# EAGLE design carrierboard (EAGLE 9.6.2)
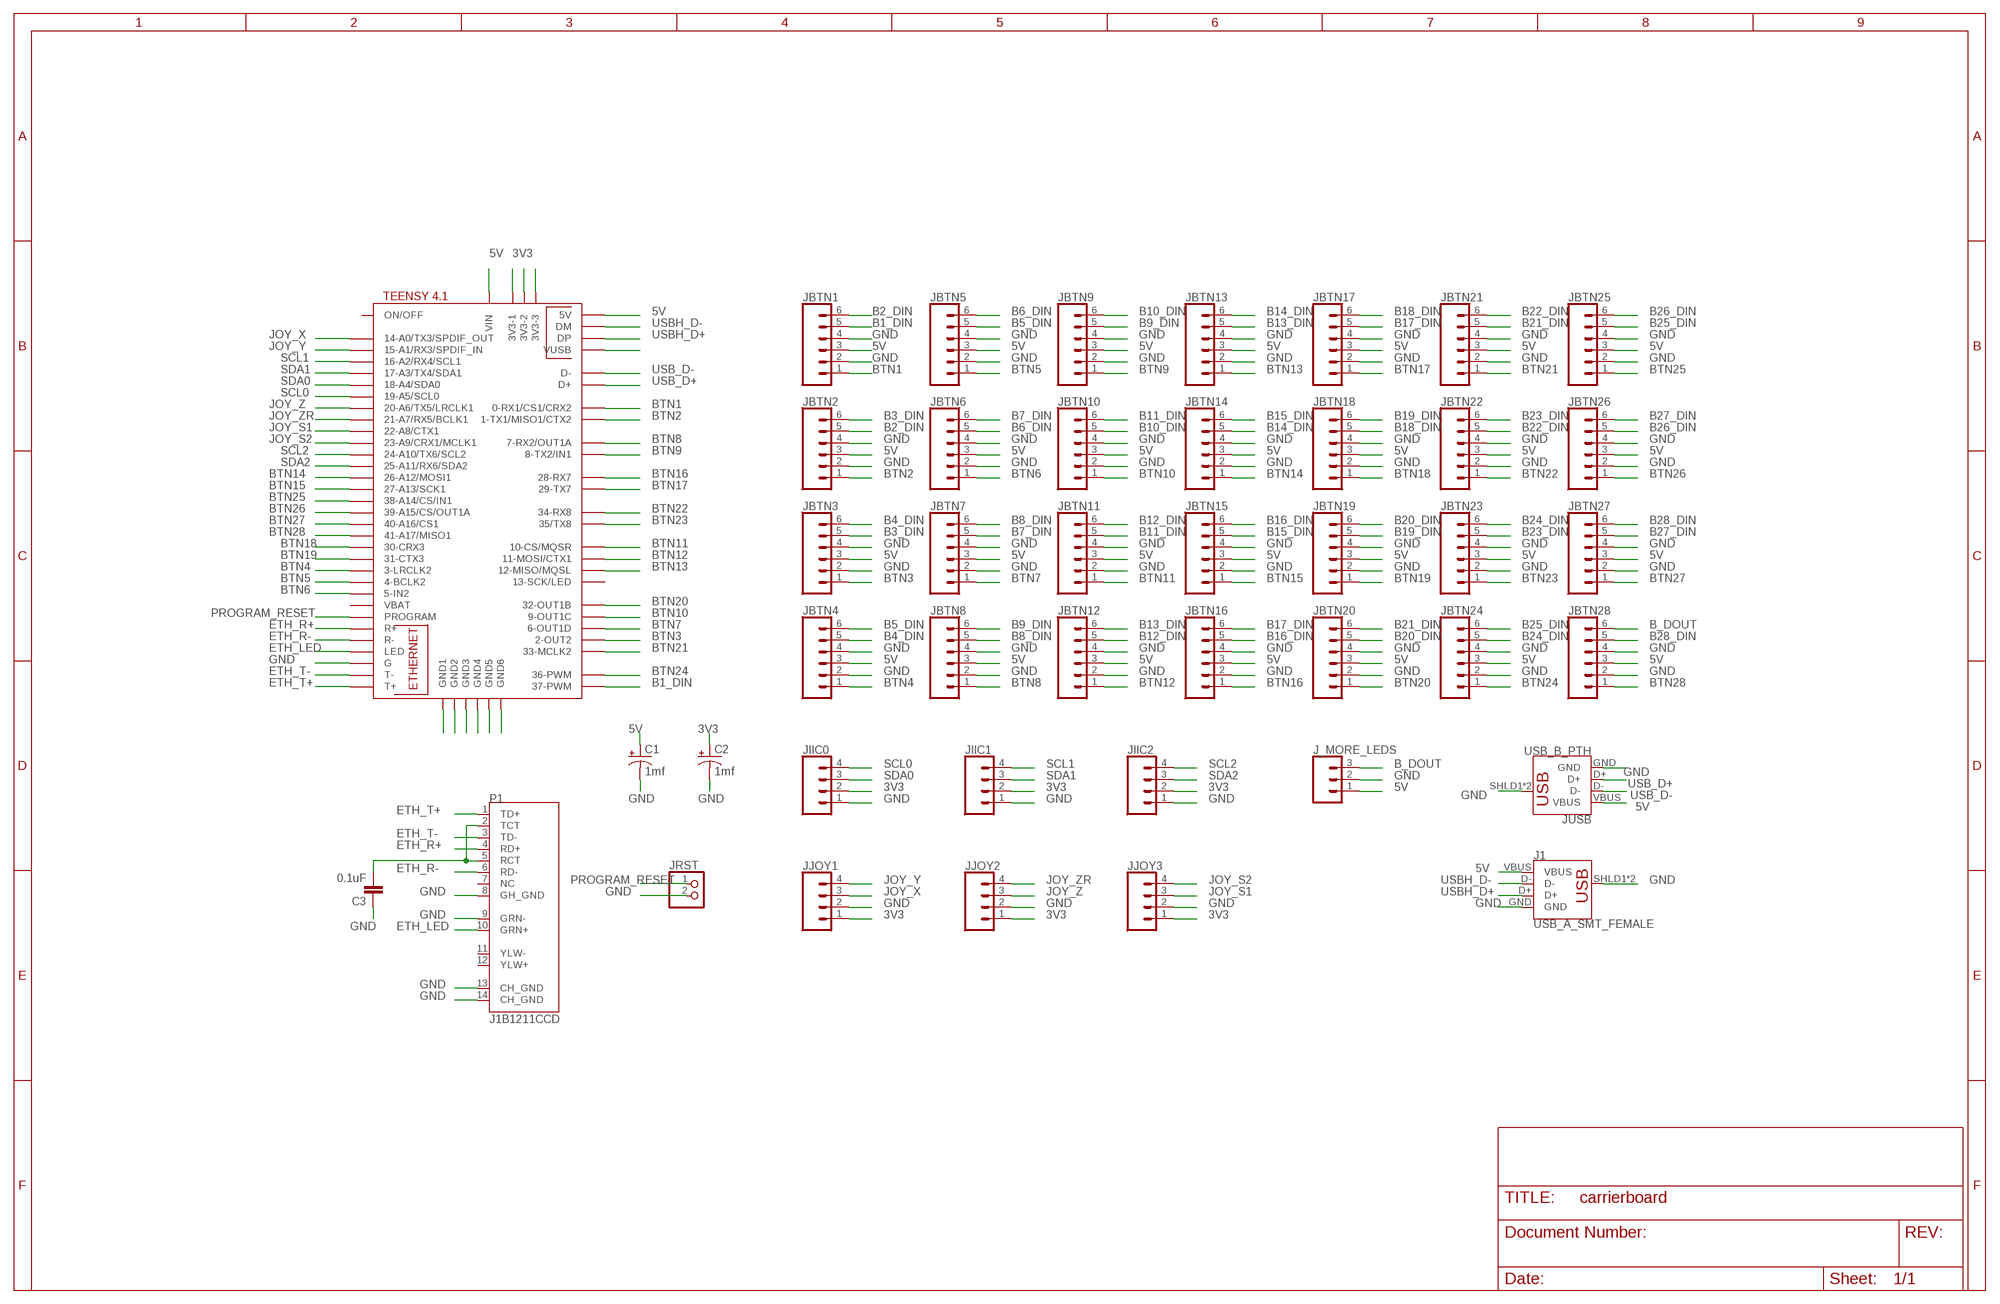
[diagram p0: schematic, sheet 1]

## Parts
C1  1mf  1000UF-RADIAL-5MM-35V-20%-KIT  [CPOL-RADIAL-5MM-10MM-KIT]
C2  1mf  1000UF-RADIAL-5MM-35V-20%-KIT  [CPOL-RADIAL-5MM-10MM-KIT]
C3  0.1uF  0.1UF-KIT-EZ-50V-20%  [CAP-PTH-SMALL-KIT]
J1  USB_A_SMT_FEMALE  [USB-A-S-SILK-FEMALE]
J_MORE_LEDS  CONN_03LONGPADS  [1X03_LONGPADS]
JBTN1  CONN_06SILK_FEMALE_PTH  [1X06]
JBTN2  CONN_06SILK_FEMALE_PTH  [1X06]
JBTN3  CONN_06SILK_FEMALE_PTH  [1X06]
JBTN4  CONN_06SILK_FEMALE_PTH  [1X06]
JBTN5  CONN_06SILK_FEMALE_PTH  [1X06]
JBTN6  CONN_06SILK_FEMALE_PTH  [1X06]
JBTN7  CONN_06SILK_FEMALE_PTH  [1X06]
JBTN8  CONN_06SILK_FEMALE_PTH  [1X06]
JBTN9  CONN_06SILK_FEMALE_PTH  [1X06]
JBTN10  CONN_06SILK_FEMALE_PTH  [1X06]
JBTN11  CONN_06SILK_FEMALE_PTH  [1X06]
JBTN12  CONN_06SILK_FEMALE_PTH  [1X06]
JBTN13  CONN_06SILK_FEMALE_PTH  [1X06]
JBTN14  CONN_06SILK_FEMALE_PTH  [1X06]
JBTN15  CONN_06SILK_FEMALE_PTH  [1X06]
JBTN16  CONN_06SILK_FEMALE_PTH  [1X06]
JBTN17  CONN_06SILK_FEMALE_PTH  [1X06]
JBTN18  CONN_06SILK_FEMALE_PTH  [1X06]
JBTN19  CONN_06SILK_FEMALE_PTH  [1X06]
JBTN20  CONN_06SILK_FEMALE_PTH  [1X06]
JBTN21  CONN_06SILK_FEMALE_PTH  [1X06]
JBTN22  CONN_06SILK_FEMALE_PTH  [1X06]
JBTN23  CONN_06SILK_FEMALE_PTH  [1X06]
JBTN24  CONN_06SILK_FEMALE_PTH  [1X06]
JBTN25  CONN_06SILK_FEMALE_PTH  [1X06]
JBTN26  CONN_06SILK_FEMALE_PTH  [1X06]
JBTN27  CONN_06SILK_FEMALE_PTH  [1X06]
JBTN28  CONN_06SILK_FEMALE_PTH  [1X06]
JIIC0  CONN_04POLAR  [MOLEX-1X4]
JIIC1  CONN_04POLAR  [MOLEX-1X4]
JIIC2  CONN_04POLAR  [MOLEX-1X4]
JJOY1  CONN_04LONGPADS  [1X04_LONGPADS]
JJOY2  CONN_04LONGPADS  [1X04_LONGPADS]
JJOY3  CONN_04LONGPADS  [1X04_LONGPADS]
JRST  PINHD-1X2  [1X02]
JUSB  USB_B_PTH  [USB-B-PTH]
P1  J1B1211CCD  [J1B1211CCD]
U$1  TEENSY41  [TEENSY41]

## Nets
3V3 [Power and Gnd]: C2.+ JIIC0.2 JIIC1.2 JIIC2.2 JJOY1.1 JJOY2.1 JJOY3.1 U$1.3V3-1 U$1.3V3-2 U$1.3V3-3
5V [Power and Gnd]: C1.+ J1.VBUS J_MORE_LEDS.1 JBTN1.3 JBTN2.3 JBTN3.3 JBTN4.3 JBTN5.3 JBTN6.3 JBTN7.3 JBTN8.3 JBTN9.3 JBTN10.3 JBTN11.3 JBTN12.3 JBTN13.3 JBTN14.3 JBTN15.3 JBTN16.3 JBTN17.3 JBTN18.3 JBTN19.3 JBTN20.3 JBTN21.3 JBTN22.3 JBTN23.3 JBTN24.3 JBTN25.3 JBTN26.3 JBTN27.3 JBTN28.3 JUSB.VBUS U$1.+5V(5V) U$1.VIN
B1_DIN: JBTN1.5 U$1.37-PWM
B2_DIN: JBTN1.6 JBTN2.5
B3_DIN: JBTN2.6 JBTN3.5
B4_DIN: JBTN3.6 JBTN4.5
B5_DIN: JBTN4.6 JBTN5.5
B6_DIN: JBTN5.6 JBTN6.5
B7_DIN: JBTN6.6 JBTN7.5
B8_DIN: JBTN7.6 JBTN8.5
B9_DIN: JBTN8.6 JBTN9.5
B10_DIN: JBTN9.6 JBTN10.5
B11_DIN: JBTN10.6 JBTN11.5
B12_DIN: JBTN11.6 JBTN12.5
B13_DIN: JBTN12.6 JBTN13.5
B14_DIN: JBTN13.6 JBTN14.5
B15_DIN: JBTN14.6 JBTN15.5
B16_DIN: JBTN15.6 JBTN16.5
B17_DIN: JBTN16.6 JBTN17.5
B18_DIN: JBTN17.6 JBTN18.5
B19_DIN: JBTN18.6 JBTN19.5
B20_DIN: JBTN19.6 JBTN20.5
B21_DIN: JBTN20.6 JBTN21.5
B22_DIN: JBTN21.6 JBTN22.5
B23_DIN: JBTN22.6 JBTN23.5
B24_DIN: JBTN23.6 JBTN24.5
B25_DIN: JBTN24.6 JBTN25.5
B26_DIN: JBTN25.6 JBTN26.5
B27_DIN: JBTN26.6 JBTN27.5
B28_DIN: JBTN27.6 JBTN28.5
B_DOUT: J_MORE_LEDS.3 JBTN28.6
BTN1: JBTN1.1 U$1.0-RX1/CS1/CRX2
BTN2: JBTN2.1 U$1.1-TX1/MISO1/CTX2
BTN3: JBTN3.1 U$1.2-OUT2
BTN4: JBTN4.1 U$1.3-LRCLK2
BTN5: JBTN5.1 U$1.4-BCLK2
BTN6: JBTN6.1 U$1.5-IN2
BTN7: JBTN7.1 U$1.6-OUT1D
BTN8: JBTN8.1 U$1.7-RX2/OUT1A
BTN9: JBTN9.1 U$1.8-TX2/IN1
BTN10: JBTN10.1 U$1.9-OUT1C
BTN11: JBTN11.1 U$1.10-CS\MQSR(10-CS/MQSR)
BTN12: JBTN12.1 U$1.11-MOSI/CTX1
BTN13: JBTN13.1 U$1.12-MISO/MQSL
BTN14: JBTN14.1 U$1.26-A12/MOSI1
BTN15: JBTN15.1 U$1.27-A13/SCK1
BTN16: JBTN16.1 U$1.28-RX7
BTN17: JBTN17.1 U$1.29-TX7
BTN18: JBTN18.1 U$1.30-CRX3
BTN19: JBTN19.1 U$1.31-CTX3
BTN20: JBTN20.1 U$1.32-OUT1B
BTN21: JBTN21.1 U$1.33-MCLK2
BTN22: JBTN22.1 U$1.34-RX8
BTN23: JBTN23.1 U$1.35-TX8(35/TX8)
BTN24: JBTN24.1 U$1.36-PWM
BTN25: JBTN25.1 U$1.38-A14/CS/IN1
BTN26: JBTN26.1 U$1.39-A15/CS/OUT1A
BTN27: JBTN27.1 U$1.40-A16/CS1
BTN28: JBTN28.1 U$1.41-A17/MISO1
ETH_LED: P1.10(GRN+) U$1.LED
ETH_R+: P1.4(RD+) U$1.R+
ETH_R-: P1.6(RD-) U$1.R-
ETH_T+: P1.1(TD+) U$1.T+
ETH_T-: P1.3(TD-) U$1.T-
GND [Power and Gnd]: C1.- C2.- C3.1 J1.GND J1.SHLD1(SHIELD) J1.SHLD2(SHIELD) J_MORE_LEDS.2 JBTN1.2 JBTN1.4 JBTN2.2 JBTN2.4 JBTN3.2 JBTN3.4 JBTN4.2 JBTN4.4 JBTN5.2 JBTN5.4 JBTN6.2 JBTN6.4 JBTN7.2 JBTN7.4 JBTN8.2 JBTN8.4 JBTN9.2 JBTN9.4 JBTN10.2 JBTN10.4 JBTN11.2 JBTN11.4 JBTN12.2 JBTN12.4 JBTN13.2 JBTN13.4 JBTN14.2 JBTN14.4 JBTN15.2 JBTN15.4 JBTN16.2 JBTN16.4 JBTN17.2 JBTN17.4 JBTN18.2 JBTN18.4 JBTN19.2 JBTN19.4 JBTN20.2 JBTN20.4 JBTN21.2 JBTN21.4 JBTN22.2 JBTN22.4 JBTN23.2 JBTN23.4 JBTN24.2 JBTN24.4 JBTN25.2 JBTN25.4 JBTN26.2 JBTN26.4 JBTN27.2 JBTN27.4 JBTN28.2 JBTN28.4 JIIC0.1 JIIC1.1 JIIC2.1 JJOY1.2 JJOY2.2 JJOY3.2 JRST.2 JUSB.GND JUSB.SHLD1(SHIELD) JUSB.SHLD2(SHIELD) P1.8(GH_GND) P1.9(GRN-) P1.13(CH_GND) P1.14(CH_GND) U$1.G U$1.GND1 U$1.GND2 U$1.GND3 U$1.GND4 U$1.GND5 U$1.GND6
JOY_S1: JJOY3.3 U$1.22-A8/CTX1
JOY_S2: JJOY3.4 U$1.23-A9/CRX1/MCLK1
JOY_X: JJOY1.3 U$1.14-A0/TX3/SPDIF_OUT
JOY_Y: JJOY1.4 U$1.15-A1/RX3/SPDIF_IN
JOY_Z: JJOY2.3 U$1.20-A6/TX5/LRCLK1
JOY_ZR: JJOY2.4 U$1.21-A7/RX5/BCLK1
N$1: C3.2 P1.2(TCT) P1.5(RCT)
N$10: U$1.VUSB
PROGRAM_RESET: JRST.1 U$1.PROGRAM
SCL0: JIIC0.4 U$1.19-A5/SCL0
SCL1: JIIC1.4 U$1.16-A2/RX4/SCL1
SCL2: JIIC2.4 U$1.24-A10/TX6/SCL2
SDA0: JIIC0.3 U$1.18-A4/SDA0
SDA1: JIIC1.3 U$1.17-A3/TX4/SDA1
SDA2: JIIC2.3 U$1.25-A11/RX6/SDA2
USB_D+: JUSB.D+ U$1.D+
USB_D-: JUSB.D- U$1.D-
USBH_D+: J1.D+ U$1.DP
USBH_D-: J1.D- U$1.DM
Unconnected: P1.7(NC) P1.11(YLW-) P1.12(YLW+) U$1.13-SCK/LED U$1.ON/OFF U$1.VBAT

## Library data of the parts
C1 C2 = SparkFun-Capacitors:1000UF: 1,000µF/1mF ceramic capacitors A capacitor is a passive two-terminal electrical component used to store electrical energy temporarily in an electric field. CAP-08070; PROD_ID: CAP-09538
C3 = SparkFun-Capacitors:0.1UF: 0.1µF ceramic capacitors A capacitor is a passive two-terminal electrical component used to store electrical energy temporarily in an electric field.; PROD_ID: CAP-08370
J1 = SparkFun-Connectors:USB_A: USB-A Connector Male and female variants, as well as PTH and SMT variants SparkFun Products: SparkFun XBee Explorer Dongle <https://www.sparkfun.com/products/11697> PTH Male SparkFun MicroView-USB Programmer <https://www.sparkfun.com/products/12924> SMT Male SparkFun USB Type A Female Breakout <https://www.sparkfun.com/products/12700> SMT Female; PROD_ID: CONN-09520; SF_ID: PRT-09011
J_MORE_LEDS = SparkFun-Connectors:CONN_03: Multi connection point. Often used as Generic Header-pin footprint for 0.1 inch spaced/style header connections On any of the 0.1 inch spaced packages, you can populate with these: Break Away Headers - Straight <https://www.sparkfun.com/products/116> (PRT-00116) Break Away Male Headers - Right Angle <https://www.sparkfun.com/products/553> (PRT-00553) Female Headers <https://www.sparkfun.com/products/115> (PRT-00115) Break Away Headers - Machine Pin <https://www.sparkfun.com/products/117> (PRT-00117) Break Away Female Headers - Swiss Machine Pin <https://www.sparkfun.com/products/743> (PRT-00743) Stackable Header - 3 Pin (Female, 0.1") <https://www.sparkfun.com/products/13875> (PRT-13875) For SCREWTERMINALS and SPRING TERMINALS visit here: Screw Terimnals on SparkFun.com <https://www.sparkfun.com/search/results?term=Screw+Terminals> (5mm/3.5mm/2.54mm spacing) This device is also useful as a general connection point to wire up your design to another part of your project. Our various solder wires solder well into these plated through hole pads. Hook-Up Wire - Assortment (Stranded, 22 AWG) <https://www.sparkfun.com/products/11375> (PRT-11375) Hook-Up Wire - Assortment (Solid Core, 22 AWG) <https://www.sparkfun.com/products/11367> (PRT-11367) View the entire wire category on our website here <https://www.sparkfun.com/categories/141> Special notes: Molex polarized connector foot print use with SKU : PRT-08232 with associated crimp pins and housings.
JBTN1-JBTN28 = SparkFun-Connectors:CONN_06: Multi connection point. Often used as Generic Header-pin footprint for 0.1 inch spaced/style header connections On any of the 0.1 inch spaced packages, you can populate with these: Break Away Headers - Straight <https://www.sparkfun.com/products/116> (PRT-00116) Break Away Male Headers - Right Angle <https://www.sparkfun.com/products/553> (PRT-00553) Female Headers <https://www.sparkfun.com/products/115> (PRT-00115) Break Away Headers - Machine Pin <https://www.sparkfun.com/products/117> (PRT-00117) Break Away Female Headers - Swiss Machine Pin <https://www.sparkfun.com/products/743> (PRT-00743) Arduino Stackable Header - 6 Pin <https://www.sparkfun.com/products/9280> (PRT-09280) For SCREWTERMINALS and SPRING TERMINALS visit here: Screw Terimnals on SparkFun.com <https://www.sparkfun.com/search/results?term=Screw+Terminals> (5mm/3.5mm/2.54mm spacing) This device is also useful as a general connection point to wire up your design to another part of your project. Our various solder wires solder well into these plated through hole pads. Hook-Up Wire - Assortment (Stranded, 22 AWG) <https://www.sparkfun.com/products/11375> (PRT-11375) Hook-Up Wire - Assortment (Solid Core, 22 AWG) <https://www.sparkfun.com/products/11367> (PRT-11367) View the entire wire category on our website here <https://www.sparkfun.com/categories/141>; PROD_ID: CONN-08437
JIIC0 JIIC1 JIIC2 = SparkFun-Connectors:CONN_04: Multi connection point. Often used as Generic Header-pin footprint for 0.1 inch spaced/style header connections On any of the 0.1 inch spaced packages, you can populate with these: Break Away Headers - Straight <https://www.sparkfun.com/products/116> (PRT-00116) Break Away Male Headers - Right Angle <https://www.sparkfun.com/products/553> (PRT-00553) Female Headers <https://www.sparkfun.com/products/115> (PRT-00115) Break Away Headers - Machine Pin <https://www.sparkfun.com/products/117> (PRT-00117) Break Away Female Headers - Swiss Machine Pin <https://www.sparkfun.com/products/743> (PRT-00743) For SCREWTERMINALS and SPRING TERMINALS visit here: Screw Terimnals on SparkFun.com <https://www.sparkfun.com/search/results?term=Screw+Terminals> (5mm/3.5mm/2.54mm spacing) This device is also useful as a general connection point to wire up your design to another part of your project. Our various solder wires solder well into these plated through hole pads. Hook-Up Wire - Assortment (Stranded, 22 AWG) <https://www.sparkfun.com/products/11375> (PRT-11375) Hook-Up Wire - Assortment (Solid Core, 22 AWG) <https://www.sparkfun.com/products/11367> (PRT-11367) View the entire wire category on our website here <https://www.sparkfun.com/categories/141> Special notes: Molex polarized connector foot print use with SKU : PRT-08231 with associated crimp pins and housings. 1MM SMD Version SKU: PRT-10208; PROD_ID: CONN-08186; SF_ID: PRT-08231
JJOY1-JJOY3 = SparkFun-Connectors:CONN_04: Multi connection point. Often used as Generic Header-pin footprint for 0.1 inch spaced/style header connections On any of the 0.1 inch spaced packages, you can populate with these: Break Away Headers - Straight <https://www.sparkfun.com/products/116> (PRT-00116) Break Away Male Headers - Right Angle <https://www.sparkfun.com/products/553> (PRT-00553) Female Headers <https://www.sparkfun.com/products/115> (PRT-00115) Break Away Headers - Machine Pin <https://www.sparkfun.com/products/117> (PRT-00117) Break Away Female Headers - Swiss Machine Pin <https://www.sparkfun.com/products/743> (PRT-00743) For SCREWTERMINALS and SPRING TERMINALS visit here: Screw Terimnals on SparkFun.com <https://www.sparkfun.com/search/results?term=Screw+Terminals> (5mm/3.5mm/2.54mm spacing) This device is also useful as a general connection point to wire up your design to another part of your project. Our various solder wires solder well into these plated through hole pads. Hook-Up Wire - Assortment (Stranded, 22 AWG) <https://www.sparkfun.com/products/11375> (PRT-11375) Hook-Up Wire - Assortment (Solid Core, 22 AWG) <https://www.sparkfun.com/products/11367> (PRT-11367) View the entire wire category on our website here <https://www.sparkfun.com/categories/141> Special notes: Molex polarized connector foot print use with SKU : PRT-08231 with associated crimp pins and housings. 1MM SMD Version SKU: PRT-10208; PROD_ID: CONN-09696
JRST = pinhead:PINHD-1X2: PIN HEADER
JUSB = SparkFun-Connectors:USB_B: USB Type B Connector SparkFun Products: SparkFun Stepoko <https://www.sparkfun.com/products/13899> PTH; PROD_ID: CONN-08278; SF_ID: PRT-00139
P1 = WIZnet:J1B1211CCD: J1B1211CCD SINGLE RJ45 CONNECTOR MODULE WITH 10/100 BASE-TX MAGNETICS AND LEDS. -Suitable for CAT 5 & 6 Fast Ethernet Cable or better UTP. -Meets or exceeds IEEE 802.3 standard for 100 Base-T. -350 µH minimum OCL with 8 mA bias current. -Minimum 1500 Vrms isolation per IEEE 802.3 requirement. -All materials are RoHS and UL94-V0 compliant. -RoHS peak solder rating 260°C. -Meet EN60950-1 basic insulation requirement. -Recommended panel.
U$1 = teensy:TEENSY41

## Net classes
0 default: width 0.254 mm
1 Power and Gnd: width 0.508 mm

## Board
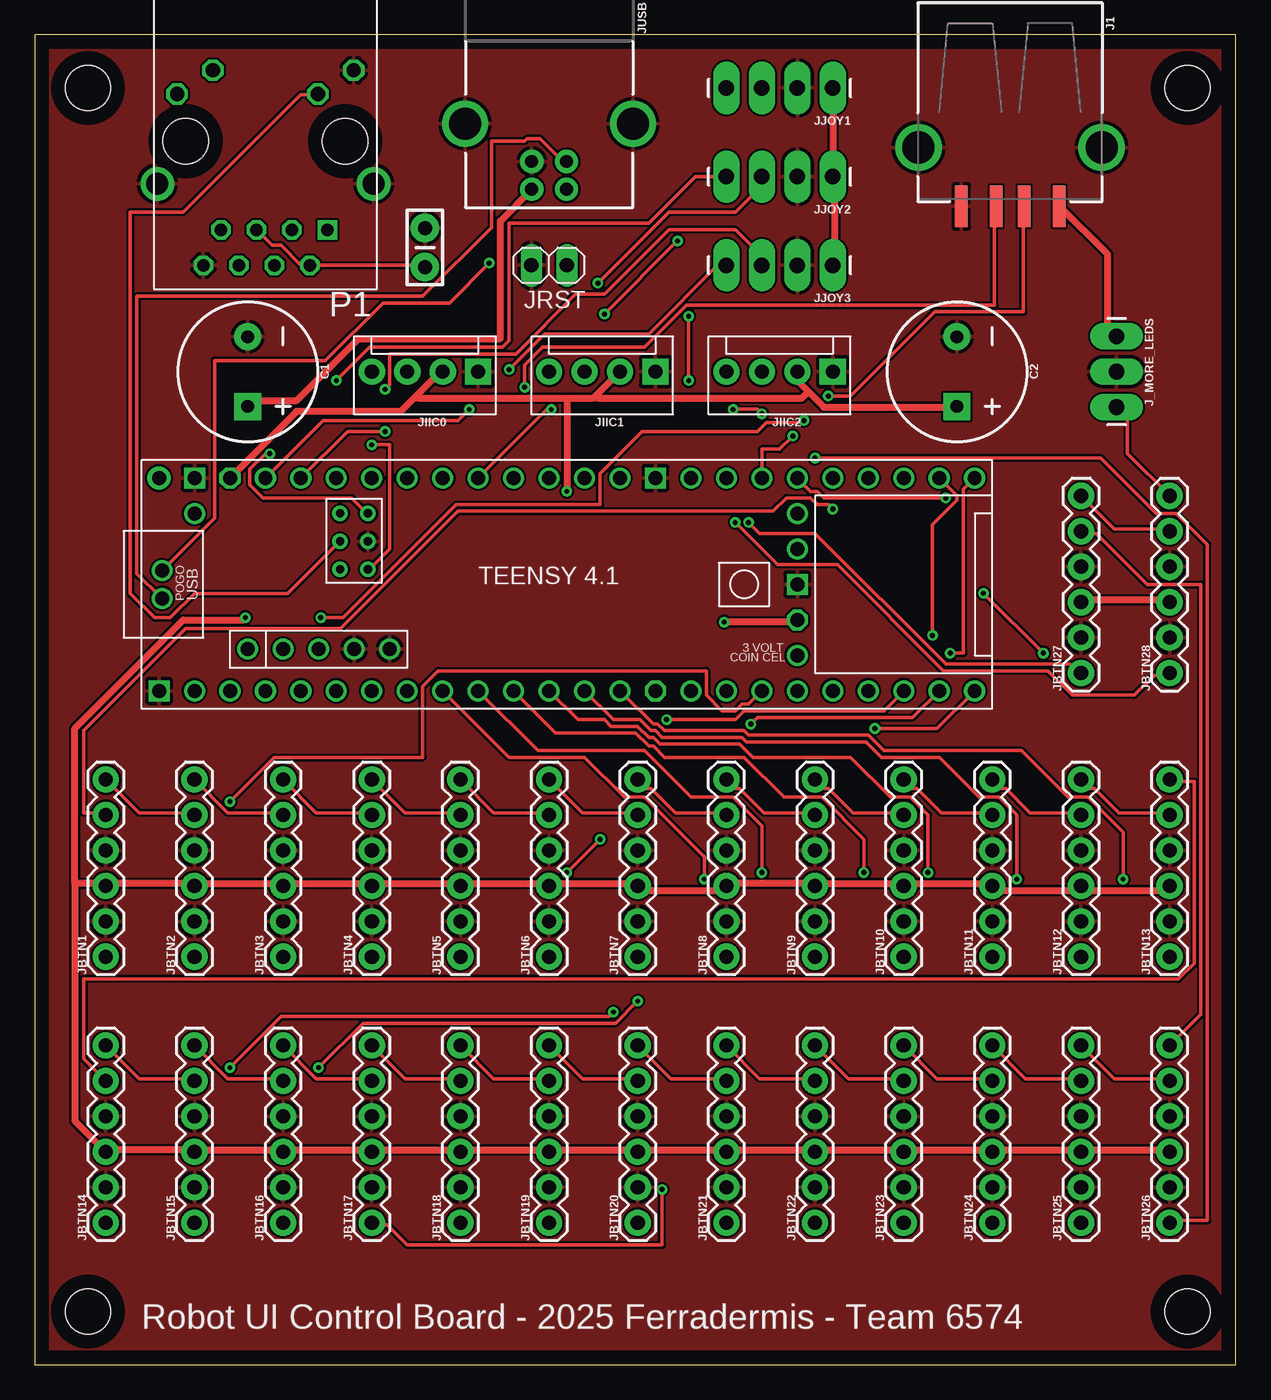
[diagram p1: board, top side]
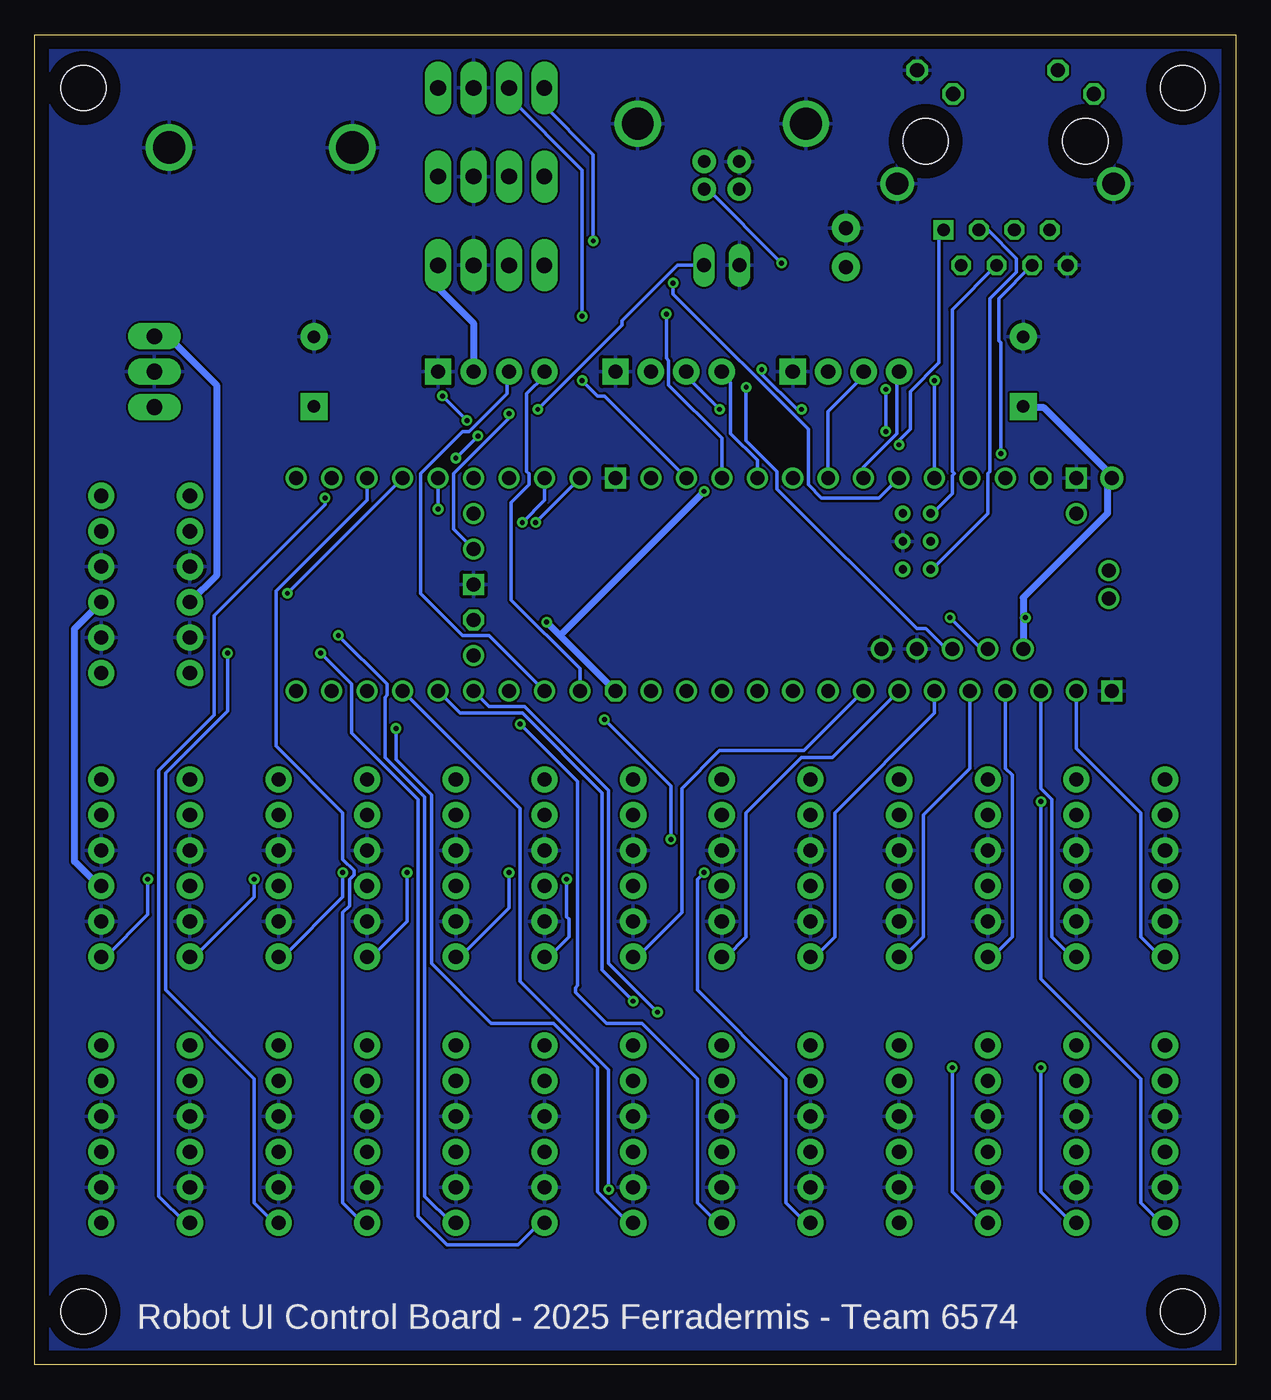
[diagram p2: board, bottom side, seen from below]

Size 86.03 x 95.24 mm. Coordinates in mm from the lower left corner, seen from the top.
Outline: 0,0 86.03,0 86.03,95.24 0,95.24 0,0
Copper layers (1*16): Top 0.035mm / dielectric 1.5mm / Bottom 0.035mm
Design rules "default": minimum track width 6mil, minimum drill 0.35mm, track to track 6mil, track to pad 6mil, pad to pad 6mil, via to via 6mil, smd to smd 6mil, copper to edge 40mil, drill to drill 6mil, minimum pad ring 10mil, minimum via ring 8mil, stop-mask expansion 4mil, vias tented up to drill 0mil, thermal gap 10mil
Holes 3.23 mm at 3.81,3.81 3.81,91.44 82.55,91.44 82.55,3.81

### Footprints (pad centres in the part's own frame; a part is rotated, then mirrored left to right if it is on the bottom)
CPOL-RADIAL-5MM-10MM-KIT = drill 0.9 pad 1.93 square: + 2.5,0 | drill 0.9 pad 1.93: - -2.5,0
CAP-PTH-SMALL-KIT = drill 1.016 pad 2.032: 1 -1.397,0; 2 1.397,0
USB-A-S-SILK-FEMALE = smd 3 x 0.9: D+ 7.212,-1; D- 7.212,1; GND 7.212,-3.5; VBUS 7.212,3.5 | drill 2.311: SHLD1 3,-6.566; SHLD2 3,6.566
1X03_LONGPADS = drill 1.118 pad 1.88 long: 1 0,0; 2 2.54,0; 3 5.08,0
1X06 = drill 1.016 pad 1.88: 1 0,0; 2 2.54,0; 3 5.08,0; 4 7.62,0; 5 10.16,0; 6 12.7,0
MOLEX-1X4 = drill 1.016 pad 1.88 square: 1 0,0 | drill 1.016 pad 1.88: 2 2.54,0; 3 5.08,0; 4 7.62,0
1X04_LONGPADS = drill 1.118 pad 1.88 long: 1 0,0; 2 2.54,0; 3 5.08,0; 4 7.62,0
1X02 = drill 1.016 long: 1 -1.27,0; 2 1.27,0
USB-B-PTH = drill 0.914 pad 1.676: D+ 4,1.25; D- 5.981,1.25; GND 4,-1.25; VBUS 5.981,-1.25 | drill 2.286: SHLD1 1.282,-6.02; SHLD2 1.282,6.02
J1B1211CCD = drill 0.9 square: 1 -4.445,6.35 | drill 0.9 octagon: 2 -3.175,8.89; 3 -1.905,6.35; 4 -0.635,8.89; 5 0.635,6.35; 6 1.905,8.89; 7 3.175,6.35; 8 4.445,8.89 | drill 1.02 octagon: 9 -6.325,-5.08; 10 -3.758,-3.38; 11 3.758,-5.08; 12 6.325,-3.38 | drill 1.6: 13 -7.75,3.05; 14 7.75,3.05 | hole 3.25: -5.715,0; 5.715,0
TEENSY41 = drill 1: 0-RX1/CS1/CRX2 -27.94,-7.62; 1-TX1/MISO1/CTX2 -25.4,-7.62; 2-OUT2 -22.86,-7.62; 3-LRCLK2 -20.32,-7.62; 4-BCLK2 -17.78,-7.62; 5-IN2 -15.24,-7.62; 6-OUT1D -12.7,-7.62; 7-RX2/OUT1A -10.16,-7.62; 8-TX2/IN1 -7.62,-7.62; 9-OUT1C -5.08,-7.62; 10-CS\MQSR -2.54,-7.62; 11-MOSI/CTX1 0,-7.62; 12-MISO/MQSL 2.54,-7.62; 13-SCK/LED 2.54,7.62; 14-A0/TX3/SPDIF_OUT 0,7.62; 15-A1/RX3/SPDIF_IN -2.54,7.62; 16-A2/RX4/SCL1 -5.08,7.62; 17-A3/TX4/SDA1 -7.62,7.62; 18-A4/SDA0 -10.16,7.62; 19-A5/SCL0 -12.7,7.62; 20-A6/TX5/LRCLK1 -15.24,7.62; 21-A7/RX5/BCLK1 -17.78,7.62; 22-A8/CTX1 -20.32,7.62; 23-A9/CRX1/MCLK1 -22.86,7.62; 24-A10/TX6/SCL2 7.62,-7.62; 25-A11/RX6/SDA2 10.16,-7.62; 26-A12/MOSI1 12.7,-7.62; 27-A13/SCK1 15.24,-7.62; 28-RX7 17.78,-7.62; 29-TX7 20.32,-7.62; 30-CRX3 22.86,-7.62; 31-CTX3 25.4,-7.62; 32-OUT1B 27.94,-7.62; 33-MCLK2 27.94,7.62; 34-RX8 25.4,7.62; 35-TX8 22.86,7.62; 36-PWM 20.32,7.62; 37-PWM 17.78,7.62; 38-A14/CS/IN1 15.24,7.62; 39-A15/CS/OUT1A 12.7,7.62; 40-A16/CS1 10.16,7.62; 41-A17/MISO1 7.62,7.62; +5V -24.13,-4.62; D+ -30.25,-1; D- -30.25,1; DM -21.59,-4.62; DP -19.05,-4.62; GND4 -16.51,-4.62; GND5 -13.97,-4.62; ON/OFF 15.24,5.08; PROGRAM 15.24,2.54; VBAT 15.24,-5.08; VUSB -27.94,5.08 | drill 1 octagon: 3V3-1 5.08,-7.62; 3V3-2 15.24,-2.54; 3V3-3 -25.4,7.62 | drill 0.6: G -15.51,3.08; LED -17.51,3.08; R+ -17.51,5.08; R- -15.51,5.08; T+ -15.51,1.08; T- -17.51,1.08 | drill 1 square: GND1 -30.48,-7.62; GND2 15.24,0; GND3 5.08,7.62; GND6 -27.94,7.62 | drill 1 pad 1.676: VIN -30.48,7.62

### Placement (x,y rotation side)
C1  15.24,71.12 270 top
C2  66.04,71.12 270 top
C3  27.94,80.01 270 top
J1  69.85,90.17 270 top
J_MORE_LEDS  77.47,73.66 270 top
JBTN1  5.08,29.21 90 top
JBTN2  11.43,29.21 90 top
JBTN3  17.78,29.21 90 top
JBTN4  24.13,29.21 90 top
JBTN5  30.48,29.21 90 top
JBTN6  36.83,29.21 90 top
JBTN7  43.18,29.21 90 top
JBTN8  49.53,29.21 90 top
JBTN9  55.88,29.21 90 top
JBTN10  62.23,29.21 90 top
JBTN11  68.58,29.21 90 top
JBTN12  74.93,29.21 90 top
JBTN13  81.28,29.21 90 top
JBTN14  5.08,10.16 90 top
JBTN15  11.43,10.16 90 top
JBTN16  17.78,10.16 90 top
JBTN17  24.13,10.16 90 top
JBTN18  30.48,10.16 90 top
JBTN19  36.83,10.16 90 top
JBTN20  43.18,10.16 90 top
JBTN21  49.53,10.16 90 top
JBTN22  55.88,10.16 90 top
JBTN23  62.23,10.16 90 top
JBTN24  68.58,10.16 90 top
JBTN25  74.93,10.16 90 top
JBTN26  81.28,10.16 90 top
JBTN27  74.93,49.53 90 top
JBTN28  81.28,49.53 90 top
JIIC0  31.75,71.12 180 top
JIIC1  44.45,71.12 180 top
JIIC2  57.15,71.12 180 top
JJOY1  57.15,91.44 180 top
JJOY2  57.15,85.09 180 top
JJOY3  57.15,78.74 180 top
JRST  36.83,78.74 180 top
JUSB  36.83,90.17 270 top
P1  16.51,87.63 180 top
U$1  39.37,55.88 0 top

### Tracks (layer width: path | path; a pad name or v marks a point on that pad's centre or on a via)
3V3  (via drill 0.35)
  Top 0.508: JJOY1.1 JJOY2.1 57.31,84.93 57.31,78.74 JJOY3.1 | 55.4,69.69 54.61,70.48 JIIC2.2 | 55.4,69.69 56.52,68.58 66.04,68.58 C2.+ | v49.37,53.18 54.45,53.18 U$1.3V3-2 | U$1.3V3-3 18.73,68.26 26.19,68.26 27.3,69.37 | 27.3,69.37 29.05,71.12 JIIC0.2 | 40.16,69.37 40.01,69.21 38.1,69.21 | 40.16,69.37 JIIC1.2 | 38.1,69.21 27.46,69.21 27.3,69.37 | 38.1,69.21 v38.1,62.55 | 55.4,69.69 54.93,69.21 40.32,69.21 40.16,69.37
  Bottom 0.508: JIIC2.2 54.61,74.61 57.15,77.15 JJOY3.1 | v49.37,53.18 48.42,52.23 | 48.42,52.23 U$1.3V3-1 | v38.1,62.55 48.42,52.23
5V  (via drill 0.35)
  Top 0.508: JBTN26.3 81.12,15.4 75.09,15.4 JBTN25.3 74.77,15.4 68.74,15.4 JBTN24.3 68.42,15.4 62.39,15.4 JBTN23.3 62.07,15.4 56.04,15.4 JBTN22.3 55.72,15.4 49.69,15.4 JBTN21.3 49.37,15.4 43.34,15.4 JBTN20.3 43.02,15.4 36.99,15.4 JBTN19.3 36.67,15.4 30.64,15.4 JBTN18.3 30.32,15.4 24.29,15.4 JBTN17.3 23.97,15.4 17.94,15.4 JBTN16.3 17.62,15.4 11.59,15.4 JBTN15.3 11.27,15.4 5.24,15.4 JBTN14.3 2.86,17.46 2.86,34.45 | JUSB.VBUS 35.56,84.14 33.34,81.91 33.34,73.5 23.18,73.5 18.73,69.06 15.56,69.06 15.24,68.74 C1.+ | JBTN27.3 75.09,54.77 81.12,54.77 JBTN28.3 | J_MORE_LEDS.1 76.84,73.66 76.84,79.53 73.5,82.87 J1.VBUS | JBTN13.3 80.96,33.97 74.93,33.97 JBTN12.3 74.61,33.97 69.37,33.97 69.22,34.13 68.74,34.13 JBTN11.3 68.42,34.45 62.39,34.45 JBTN10.3 62.07,34.45 56.04,34.45 JBTN9.3 55.72,34.45 49.69,34.45 JBTN8.3 49.21,33.97 43.97,33.97 43.81,34.13 43.34,34.13 JBTN7.3 43.02,34.45 36.99,34.45 JBTN6.3 36.67,34.45 30.64,34.45 JBTN5.3 30.32,34.45 24.29,34.45 JBTN4.3 23.97,34.45 17.94,34.45 JBTN3.3 17.62,34.45 11.59,34.45 JBTN2.3 11.27,34.45 5.24,34.45 JBTN1.3 4.92,34.45 2.86,34.45 | v15.08,53.5 14.92,53.34 10.64,53.34 2.86,45.56 2.86,34.45
  Bottom 0.508: 15.24,53.5 15.24,54.93 9.21,60.96 9.21,63.18 U$1.VIN 9.05,63.66 9.05,63.82 13.81,68.58 15.24,68.58 C1.+ | 15.24,53.5 U$1.+5V | JBTN27.3 73.03,56.52 73.03,70.17 76.52,73.66 J_MORE_LEDS.1 | JBTN28.3 83.19,52.7 83.19,36.04 81.44,34.29 JBTN13.3 | v15.08,53.5 15.24,53.5
B1_DIN  (via drill 0.35)
  Top 0.254: v57.15,61.28 56.83,61.6 56.04,61.6 55.56,62.07 53.82,62.07 52.86,61.12 30.32,61.12 21.91,52.7 10.8,52.7 3.49,45.4 3.49,39.53 4.92,39.53 JBTN1.5
  Bottom 0.254: v57.15,61.28 U$1.37-PWM
B2_DIN
  Top 0.254: JBTN1.6 7.46,39.53 11.27,39.53 JBTN2.5
B3_DIN
  Top 0.254: JBTN2.6 13.81,39.53 17.62,39.53 JBTN3.5
B4_DIN
  Top 0.254: JBTN3.6 20.16,39.53 23.97,39.53 JBTN4.5
B5_DIN
  Top 0.254: JBTN4.6 26.51,39.53 30.32,39.53 JBTN5.5
B6_DIN
  Top 0.254: JBTN5.6 32.86,39.53 36.67,39.53 JBTN6.5
B7_DIN
  Top 0.254: JBTN6.6 39.21,39.53 43.02,39.53 JBTN7.5
B8_DIN
  Top 0.254: JBTN7.6 43.81,41.27 44.13,41.27 45.88,39.53 49.37,39.53 JBTN8.5
B9_DIN
  Top 0.254: JBTN8.6 50.16,41.27 50.48,41.27 52.23,39.53 55.72,39.53 JBTN9.5
B10_DIN
  Top 0.254: JBTN9.6 56.52,41.27 56.83,41.27 58.58,39.53 62.07,39.53 JBTN10.5
B11_DIN
  Top 0.254: JBTN10.6 62.87,41.27 63.18,41.27 64.93,39.53 68.42,39.53 JBTN11.5
B12_DIN
  Top 0.254: JBTN11.6 69.22,41.27 69.53,41.27 71.28,39.53 74.77,39.53 JBTN12.5
B13_DIN
  Top 0.254: JBTN12.6 75.57,41.27 75.88,41.27 77.63,39.53 81.12,39.53 JBTN13.5
B14_DIN
  Top 0.254: JBTN14.5 3.49,21.91 3.49,27.62 81.92,27.62 83.03,28.73 83.03,41.75 81.44,41.75 JBTN13.6
B15_DIN
  Top 0.254: JBTN14.6 7.46,20.48 11.27,20.48 JBTN15.5
B16_DIN
  Top 0.254: JBTN15.6 13.81,20.48 17.62,20.48 JBTN16.5
B17_DIN
  Top 0.254: JBTN16.6 20.16,20.48 23.97,20.48 JBTN17.5
B18_DIN
  Top 0.254: JBTN17.6 26.51,20.48 30.32,20.48 JBTN18.5
B19_DIN
  Top 0.254: JBTN18.6 32.86,20.48 36.67,20.48 JBTN19.5
B20_DIN
  Top 0.254: JBTN19.6 39.21,20.48 43.02,20.48 JBTN20.5
B21_DIN
  Top 0.254: JBTN20.6 45.56,20.48 49.37,20.48 JBTN21.5
B22_DIN
  Top 0.254: JBTN21.6 51.91,20.48 55.72,20.48 JBTN22.5
B23_DIN
  Top 0.254: JBTN22.6 58.26,20.48 62.07,20.48 JBTN23.5
B24_DIN
  Top 0.254: JBTN23.6 64.61,20.48 68.42,20.48 JBTN24.5
B25_DIN
  Top 0.254: JBTN24.6 70.96,20.48 74.77,20.48 JBTN25.5
B26_DIN
  Top 0.254: JBTN25.6 77.31,20.48 81.12,20.48 JBTN26.5
B27_DIN
  Top 0.254: JBTN26.6 83.5,25.08 83.5,55.88 79.69,55.88 76.04,59.53 75.09,59.53 JBTN27.5
B28_DIN
  Top 0.254: JBTN27.6 77.31,59.85 81.12,59.85 JBTN28.5
B_DOUT
  Top 0.254: JBTN28.6 78.26,65.25 78.26,68.58 J_MORE_LEDS.3
BTN1
  Bottom 0.254: U$1.0-RX1/CS1/CRX2 11.43,44.13 6.83,39.53 6.83,30.64 5.4,29.21 JBTN1.1
BTN2
  Bottom 0.254: U$1.1-TX1/MISO1/CTX2 13.97,41.27 13.18,40.48 13.18,30.64 11.75,29.21 JBTN2.1
BTN3
  Bottom 0.254: U$1.2-OUT2 16.51,42.7 16.03,42.23 16.03,30.64 17.46,29.21 JBTN3.1
BTN4
  Bottom 0.254: U$1.3-LRCLK2 19.05,42.7 22.38,39.37 22.38,30.64 23.81,29.21 JBTN4.1
BTN5
  Bottom 0.254: U$1.4-BCLK2 21.59,46.67 28.73,39.53 28.73,30.64 30.16,29.21 JBTN5.1
BTN6
  Bottom 0.254: U$1.5-IN2 28.89,43.5 31.11,43.5 35.08,39.53 35.08,30.64 36.51,29.21 JBTN6.1
BTN7
  Bottom 0.254: U$1.6-OUT1D 30.96,43.97 36.99,43.97 39.69,41.27 39.69,32.38 42.86,29.21 JBTN7.1
BTN8  (via drill 0.35)
  Top 0.254: U$1.7-RX2/OUT1A 33.97,43.5 39.37,43.5 42.23,40.64 43.66,40.64 47.94,36.35 v47.94,34.77
  Bottom 0.254: v47.94,34.77 47.94,32.07 47.78,31.91 47.78,30.64 49.21,29.21 JBTN8.1
BTN9  (via drill 0.35)
  Top 0.254: U$1.8-TX2/IN1 36.04,43.97 43.66,43.97 46.99,40.64 50.01,40.64 52.07,38.58 v52.07,35.24
  Bottom 0.254: v52.07,35.24 52.07,32.7 55.56,29.21 JBTN9.1
BTN10  (via drill 0.35)
  Top 0.254: U$1.9-OUT1C 37.31,45.24 43.02,45.24 43.97,44.29 44.29,44.29 45.09,43.5 50.8,43.5 53.66,40.64 56.36,40.64 59.37,37.62 v59.37,35.24
  Bottom 0.254: v59.37,35.24 59.37,31.75 61.91,29.21 JBTN10.1
BTN11  (via drill 0.35)
  Top 0.254: U$1.10-CS\MQSR 38.89,46.2 40.8,46.2 41.27,45.72 43.18,45.72 43.97,44.93 44.29,44.93 44.77,44.45 50.48,44.45 51.44,43.5 58.42,43.5 61.28,40.64 62.71,40.64 63.98,39.37 v63.98,35.24
  Bottom 0.254: v63.98,35.24 63.98,33.5 68.26,29.21 JBTN11.1
BTN12  (via drill 0.35)
  Top 0.254: U$1.11-MOSI/CTX1 41.43,46.2 43.34,46.2 44.13,45.4 44.45,45.4 44.93,44.93 50.64,44.93 50.96,44.61 59.53,44.61 60.64,43.5 64.77,43.5 67.63,40.64 69.06,40.64 70.33,39.37 v70.33,34.77
  Bottom 0.254: v70.33,34.77 70.33,33.5 74.61,29.21 JBTN12.1
BTN13  (via drill 0.35)
  Top 0.254: U$1.12-MISO/MQSL 44.29,45.88 44.61,45.88 45.09,45.4 50.8,45.4 51.12,45.09 59.69,45.09 60.8,43.97 70.64,43.97 73.98,40.64 75.41,40.64 77.95,38.1 v77.95,34.77
  Bottom 0.254: v77.95,34.77 77.95,32.23 80.96,29.21 JBTN13.1
BTN14  (via drill 0.35)
  Top 0.254: U$1.26-A12/MOSI1 51.12,47.31 50.64,47.31 50.16,46.83 49.21,46.83 48.1,47.94 48.1,49.69 28.89,49.69 27.78,48.58 27.78,43.5 17.14,43.5 v13.97,40.32
  Bottom 0.254: v13.97,40.32 13.97,27.62 6.83,20.48 6.83,11.59 5.4,10.16 JBTN14.1
BTN15  (via drill 0.35)
  Top 0.254: v41.43,25.24 41.12,24.92 17.62,24.92 v13.97,21.27
  Bottom 0.254: U$1.27-A13/SCK1 53.5,47.15 50.96,47.15 44.93,41.12 44.93,28.73 v41.43,25.24 | v13.97,21.27 13.97,12.38 11.75,10.16 JBTN15.1
BTN16  (via drill 0.35)
  Top 0.254: v43.18,26.04 41.59,24.45 23.49,24.45 v20.32,21.27
  Bottom 0.254: U$1.28-RX7 55.56,46.67 51.12,46.67 45.4,40.96 45.4,28.26 v43.18,26.04 | v20.32,21.27 20.32,12.38 18.1,10.16 JBTN16.1
BTN17  (via drill 0.35)
  Top 0.254: v44.93,12.54 44.93,8.57 26.67,8.57 25.24,10 24.29,10 JBTN17.1
  Bottom 0.254: U$1.29-TX7 51.28,39.85 51.28,27.46 44.93,21.11 v44.93,12.54
BTN18  (via drill 0.35)
  Top 0.254: U$1.30-CRX3 60.8,46.83 50.8,46.83 50.16,46.2 v45.24,46.2 | v38.1,35.24 v40.48,37.62
  Bottom 0.254: v45.24,46.2 40.48,41.43 v40.48,37.62 | v38.1,35.24 38.58,34.77 38.58,26.83 32.23,20.48 32.23,11.59 30.8,10.16 JBTN18.1
BTN19  (via drill 0.35)
  Top 0.254: U$1.31-CTX3 62.87,46.36 51.75,46.36 v51.28,45.88
  Bottom 0.254: v51.28,45.88 47.15,41.75 47.15,27.15 47.31,26.99 47.31,26.67 45.09,24.45 42.55,24.45 38.58,20.48 38.58,11.59 37.15,10.16 JBTN19.1
BTN20  (via drill 0.35)
  Top 0.254: U$1.32-OUT1B 64.61,45.56 v60.17,45.56
  Bottom 0.254: v60.17,45.56 60.17,43.34 57.63,40.8 57.63,28.73 53.34,24.45 48.89,24.45 45.72,21.27 45.72,12.38 43.5,10.16 JBTN20.1
BTN21  (via drill 0.35)
  Top 0.254: U$1.33-MCLK2 66.52,62.71 66.52,50.96 v65.56,50.96
  Bottom 0.254: v65.56,50.96 63.34,48.74 63.34,45.24 58.58,40.48 58.58,10.64 56.52,8.57 51.44,8.57 49.85,10.16 JBTN21.1
BTN22  (via drill 0.35)
  Top 0.254: U$1.34-RX8 66.04,62.23 66.04,61.91 64.29,60.17 v64.29,52.23
  Bottom 0.254: v64.29,52.23 60.8,48.74 60.8,47.94 60.96,47.78 60.96,43.5 58.1,40.64 58.1,12.07 56.2,10.16 JBTN22.1
BTN23
  Bottom 0.254: U$1.35-TX8 62.23,61.91 68.74,55.4 68.74,44.29 63.98,39.53 63.98,36.2 63.18,35.4 63.18,35.08 63.5,34.77 63.5,32.86 63.98,32.38 63.98,11.59 62.55,10.16 JBTN23.1
BTN24  (via drill 0.35)
  Top 0.254: v72.23,50.96 v67.95,55.24
  Bottom 0.254: v67.95,55.24 U$1.36-PWM | v72.23,50.96 72.23,46.83 76.68,42.39 76.68,26.83 70.33,20.48 70.33,11.59 68.9,10.16 JBTN24.1
BTN25  (via drill 0.35)
  Top 0.254: U$1.38-A14/CS/IN1 55.56,62.55 56.04,62.55 56.52,62.07 v65.25,62.07
  Bottom 0.254: v65.25,62.07 65.25,61.6 73.18,53.66 73.18,46.51 77.15,42.55 77.15,12.07 75.25,10.16 JBTN25.1
BTN26  (via drill 0.35)
  Top 0.254: U$1.39-A15/CS/OUT1A 52.07,65.56 53.34,65.56 v54.29,66.52 | v55.88,64.93 76.36,64.93 80.33,60.96 81.76,60.96 83.98,58.74 83.98,10.32 81.44,10.32 JBTN26.1
  Bottom 0.254: v55.88,64.93 v54.29,66.52
BTN27  (via drill 0.35)
  Top 0.254: v51.12,60.33 51.91,59.53 55.88,59.53 65.25,50.16 74.14,50.16 74.77,49.53 JBTN27.1
  Bottom 0.254: U$1.40-A16/CS1 49.53,61.91 v51.12,60.33
BTN28  (via drill 0.35)
  Top 0.254: v50.16,60.33 53.18,57.31 57.47,57.31 65.09,49.69 72.55,49.69 74.3,47.94 78.74,47.94 80.17,49.37 81.12,49.37 JBTN28.1
  Bottom 0.254: v50.16,60.33 U$1.41-A17/MISO1
ETH_LED
  Top 0.254: U$1.LED 21.75,58.9 18.1,55.24 11.43,55.24 9.68,53.5 8.57,53.5 6.83,55.24 6.83,82.55 10.64,82.55 19.05,90.96 20.16,90.96 P1.10
ETH_R+
  Bottom 0.254: P1.4 20.32,75.56 20.32,63.98 20.16,63.82 20.32,63.66 20.32,62.39 21.75,60.96 U$1.R+
ETH_R-  (via drill 0.35)
  Top 0.254: v16.83,65.25 16.51,65.25 15.4,64.13 15.4,63.02 16.35,62.07 22.7,62.07 23.81,60.96 U$1.R-
  Bottom 0.254: v16.83,65.25 16.83,73.18 16.99,73.34 16.99,76.36 P1.6
ETH_T+  (via drill 0.35)
  Top 0.254: v24.13,65.88 25.4,65.88 25.4,58.42 23.97,56.99 U$1.T+
  Bottom 0.254: v24.13,65.88 24.13,66.2 23.34,66.99 23.34,69.69 21.27,71.75 21.27,80.96 P1.1
ETH_T-
  Bottom 0.254: P1.3 17.78,81.28 15.72,79.22 15.72,78.26 17.62,76.36 17.62,63.98 17.78,63.82 17.78,60.96 21.75,56.99 U$1.T-
GND
  pour Top: 0,95.25 86.36,95.25 86.36,0 0,0
  pour Bottom: 0,95.25 86.36,95.25 86.36,0 0,0 0,92.71
  pour Bottom: 0,95.25 86.36,95.25 86.36,0 0,0
JOY_S1  (via drill 0.35)
  Top 0.254: U$1.22-A8/CTX1 22.38,66.83 v25.08,66.83 | v25.08,69.85 25.4,70.17 25.4,72.39 34.45,72.39 38.73,76.68 40.8,76.68 45.4,81.28 50.16,81.28 52.07,79.38 JJOY3.3
  Bottom 0.254: v25.08,69.85 v25.08,66.83
JOY_S2  (via drill 0.35)
  Top 0.254: U$1.23-A9/CRX1/MCLK1 20.64,67.63 30.32,67.63 v31.11,68.42 | v33.97,71.28 36.51,73.82 43.97,73.82 48.89,78.74 JJOY3.4
  Bottom 0.254: v31.11,68.42 31.43,68.42 33.97,70.96 v33.97,71.28
JOY_X  (via drill 0.35)
  Top 0.254: v46.83,75.09 v46.83,70.48
  Bottom 0.254: U$1.14-A0/TX3/SPDIF_OUT 45.24,69.37 45.72,69.37 v46.83,70.48 | v46.83,75.09 46.83,85.57 52.07,90.8 JJOY1.3
JOY_Y  (via drill 0.35)
  Top 0.254: v46.04,80.49 v40.8,75.25
  Bottom 0.254: U$1.15-A1/RX3/SPDIF_IN 36.83,66.36 40.64,70.17 40.64,71.91 40.8,72.07 v40.8,75.25 | v46.04,80.49 46.04,86.68 49.53,90.17 JJOY1.4
JOY_Z  (via drill 0.35)
  Top 0.254: v40.32,77.47 45.4,82.55 50.16,82.55 52.07,84.45 JJOY2.3
  Bottom 0.254: U$1.20-A6/TX5/LRCLK1 25.56,62.07 29.69,62.07 30.64,63.02 30.64,66.99 40.32,76.68 v40.32,77.47
JOY_ZR  (via drill 0.35)
  Top 0.254: v21.59,70.48 23.97,72.87 33.5,72.87 33.97,73.34 33.97,81.76 43.97,81.76 47.31,85.09 JJOY2.4
  Bottom 0.254: v21.59,70.48 U$1.21-A7/RX5/BCLK1
N$1
  Top 0.254: P1.5 16.99,80.17 17.62,80.17 19.05,78.74 P1.2 27.94,78.74 C3.2
PROGRAM_RESET  (via drill 0.35)
  Top 0.254: v52.07,68.1 51.75,68.42 v50.01,68.42
  Bottom 0.254: U$1.PROGRAM 56.04,59.85 56.04,63.82 52.07,67.79 v52.07,68.1 | v50.01,68.42 43.97,74.45 43.97,74.77 40.01,78.74 JRST.1
SCL0
  Bottom 0.254: U$1.19-A5/SCL0 26.67,64.29 24.29,66.67 24.29,70.96 JIIC0.4
SCL1
  Bottom 0.254: U$1.16-A2/RX4/SCL1 34.29,64.77 36.2,66.67 36.2,70.33 36.83,70.96 JIIC1.4
SCL2
  Bottom 0.254: U$1.24-A10/TX6/SCL2 46.99,49.85 51.91,54.77 51.91,61.75 50.64,63.02 50.64,63.82 50.8,63.98 50.8,69.53 49.53,70.8 JIIC2.4
SDA0
  Bottom 0.254: U$1.18-A4/SDA0 29.21,68.26 26.67,70.8 JIIC0.3
SDA1  (via drill 0.35)
  Top 0.254: U$1.17-A3/TX4/SDA1 36.67,68.42 v36.99,68.42
  Bottom 0.254: v36.99,68.42 39.37,70.8 JIIC1.3
SDA2
  Bottom 0.254: U$1.25-A11/RX6/SDA2 53.5,52.23 55.4,52.23 58.42,55.24 58.42,63.82 55.4,66.83 54.93,66.83 52.23,69.53 52.23,70.96 JIIC2.3
USB_D+
  Top 0.254: U$1.D+ 9.05,54.93 7.3,56.67 7.3,76.52 27.78,76.52 32.7,81.44 32.7,87.63 35.08,87.63 35.24,87.79 36.2,87.79 37.78,86.2 37.94,86.2 JUSB.D+
USB_D-  (via drill 0.35)
  Top 0.254: v32.54,78.9 29.69,76.04 24.92,76.04 20.8,71.91 12.86,71.91 12.86,60.64 9.21,56.99 U$1.D-
  Bottom 0.254: v32.54,78.9 37.94,84.3 JUSB.D-
USBH_D+  (via drill 0.35)
  Top 0.254: v35.08,70.01 35.08,71.6 36.35,72.87 43.66,72.87 46.67,75.88 68.74,75.88 68.74,82.87 J1.D+
  Bottom 0.254: v35.08,70.01 35.08,66.2 32.86,63.98 32.86,62.71 22.86,52.7 22.22,52.7 20.8,51.28 20.32,51.28 U$1.DP
USBH_D-  (via drill 0.35)
  Top 0.254: v56.83,69.37 58.42,69.37 64.45,75.41 70.8,75.41 70.8,82.87 J1.D- | v55.09,67.63 54.93,67.47 52.39,67.47 51.75,66.83 43.5,66.83 40.48,63.82 40.48,61.6 30.16,61.6 22.07,53.5 v20.48,53.5
  Bottom 0.254: v55.09,67.63 v56.83,69.37 | v20.48,53.5 18.26,51.28 17.78,51.28 U$1.DM

### Text on the board
tPlace: Robot UI Control Board - 2025 Ferradermis - Team 6574
bPlace: Robot UI Control Board - 2025 Ferradermis - Team 6574